# Altium schematic sheet SD3plus.SchDoc
size 431 x 279 mm; SheetNumber: 1; SheetTotal: 1; ENG_APP_DATE: --/--/--; DSN_APP_DATE: --/--/--; CHK_APP_DATE: --/--/--
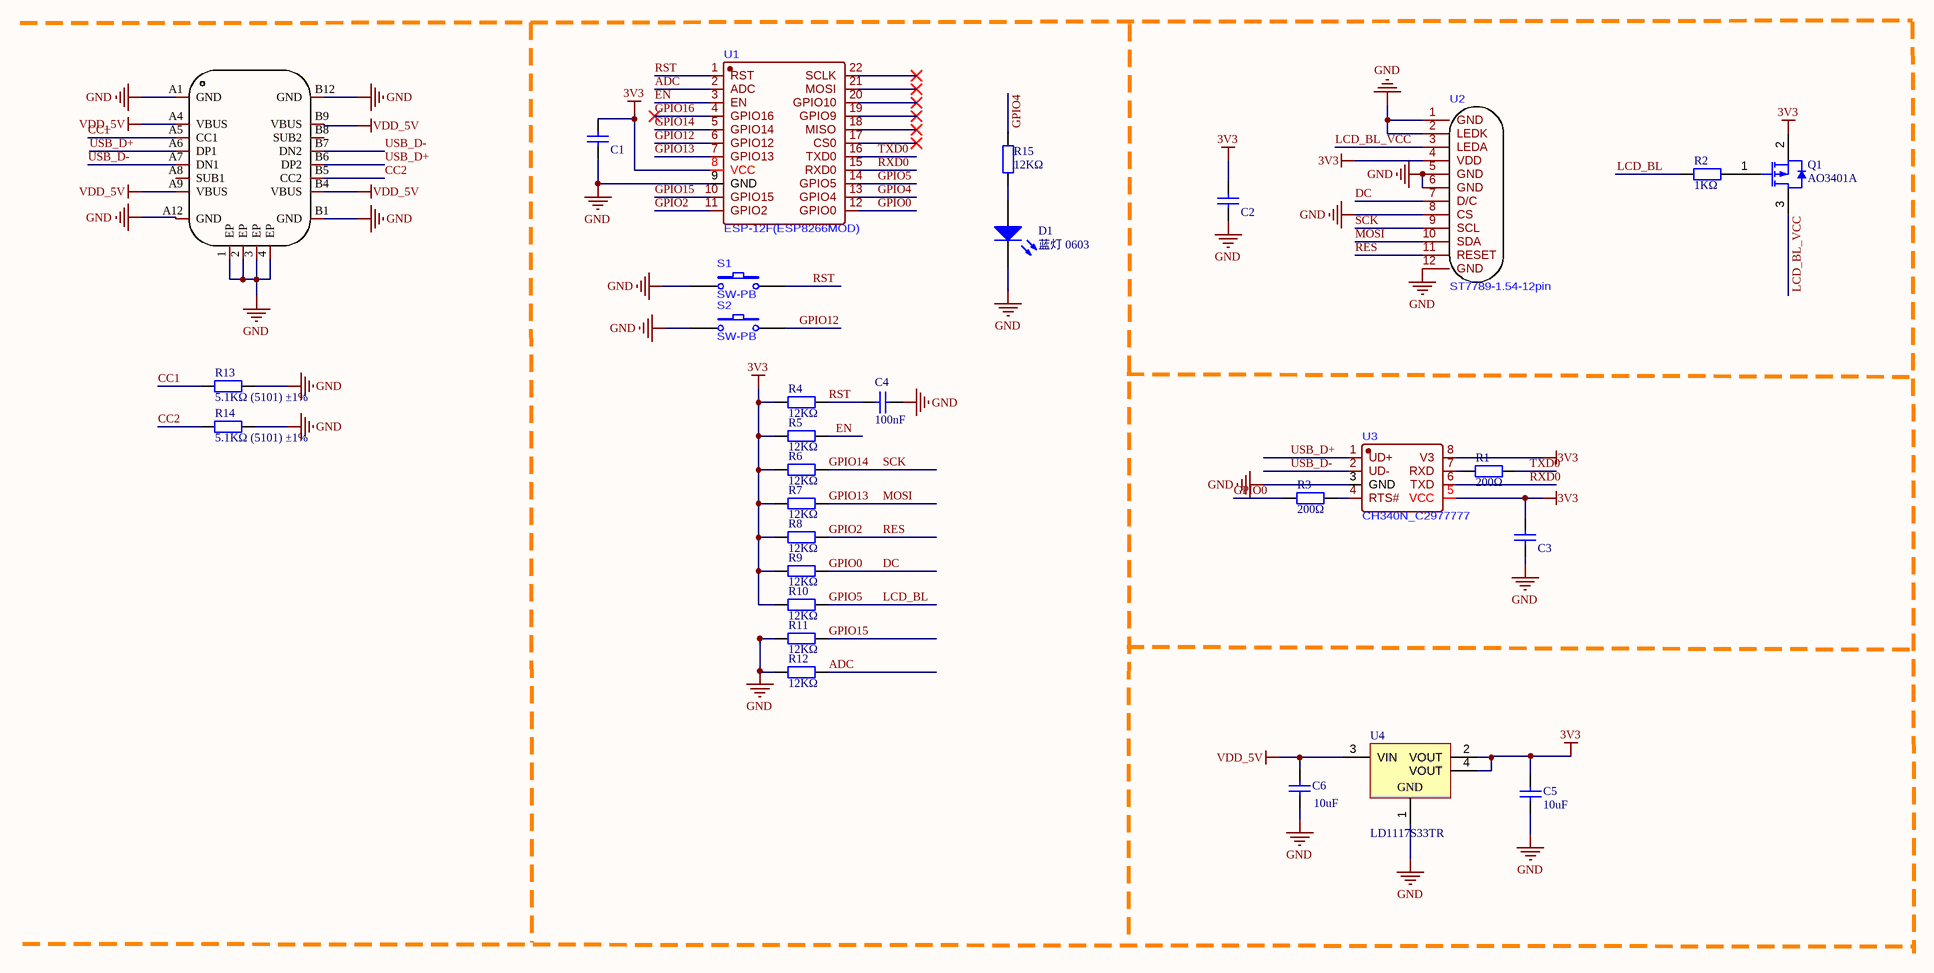
[diagram p0: SD3plus.SchDoc]

## Parts
?  KH-TYPE-C-16P  [USB-C-SMD_KH-TYPE-C-16P]  (value not drawn)
C1  0603 100nF (104) 10% 50V  [0603_C]  (value not drawn)
C2  0603 100nF (104) 10% 50V  [0603_C]  (value not drawn)
C3  0603 100nF (104) 10% 50V  [0603_C]  (value not drawn)
C4  100nF  [0603_C]
C5  10uF  [0603_C]
C6  10uF  [0603_C]
D1  蓝灯 0603  [0603_LED_S1]
Q1  AO3401A  [AO-SOT-23-3L_V]
R1  200Ω  [0603_R]
R2  1KΩ  [0603_R]
R3  200Ω  [0603_R]
R4  12KΩ  [0603_R]
R5  12KΩ  [0603_R]
R6  12KΩ  [0603_R]
R7  12KΩ  [0603_R]
R8  12KΩ  [0603_R]
R9  12KΩ  [0603_R]
R10  12KΩ  [0603_R]
R11  12KΩ  [0603_R]
R12  12KΩ  [0603_R]
R13  5.1KΩ (5101) ±1%  [0603_R]
R14  5.1KΩ (5101) ±1%  [0603_R]
R15  12KΩ  [0603_R]
S1  SW-PB  [SW-SMD_L3.9-W2.9-LS4.8-EH-A]
S2  SW-PB  [SW-SMD_L3.9-W2.9-LS4.8-EH-A]
U1  ESP-12F(ESP8266MOD)  [ESP-12F-ESP8266MOD]
U2  ST7789-1.54-12pin  [ST7789-1.54-12pin]
U3  CH340N_C2977777  [SOP-8_L4.9-W3.9-P1.27-LS6.0-BL]
U4  LD1117S33TR  [SOT-223_L]

## Nets
3V3: C1.2 C2.2 C3.2 C5.2 Q1.2(SOURCE) R4.1 R5.1 R6.1 R7.1 R8.1 R9.1 R10.1 U1.8(VCC) U2.4(VDD) U3.5(VCC) U3.8(V3) U4.2(VOUT) U4.4(VOUT)
GND: ?.1(EP) ?.2(EP) ?.3(EP) ?.4(EP) ?.A1(GND) ?.A12(GND) ?.B1(GND) ?.B12(GND) C1.1 C2.1 C3.1 C4.2 C5.1 C6.1 D1.K R11.1 R12.1 R13.2 R14.2 S1.1 S2.1 U1.9(GND) U2.1(GND) U2.2(LEDK) U2.5(GND) U2.6(GND) U2.8(CS) U2.12(GND) U3.3(GND) U4.1(GND)
VDD_5V: ?.A4(VBUS) ?.A9(VBUS) ?.B4(VBUS) ?.B9(VBUS) C6.2 U4.3(VIN)
ADC: R12.2 U1.2(ADC)
CC1: ?.A5(CC1) R13.1
CC2: ?.B5(CC2) R14.1
DC: R3.1 R9.2 U1.12(GPIO0) U2.7(D/C)  [also labelled GPIO0]
EN: R5.2 U1.3(EN)
GPIO2: R8.2 U1.11(GPIO2) U2.11(RESET)  [also labelled RES]
GPIO4: R15.1 U1.13(GPIO4)
GPIO5: R2.1 R10.2 U1.14(GPIO5)  [also labelled LCD_BL]
GPIO12: S2.2 U1.6(GPIO12)
GPIO13: R7.2 U1.7(GPIO13) U2.10(SDA)  [also labelled MOSI]
GPIO14: R6.2 U1.5(GPIO14) U2.9(SCL)  [also labelled SCK]
GPIO15: R11.2 U1.10(GPIO15)
GPIO16: U1.4(GPIO16)
LCD_BL_VCC: Q1.3(DRAIN) U2.3(LEDA)
RST: C4.1 R4.2 S1.2 U1.1(RST)
RXD0: U1.15(RXD0) U3.6(TXD)
TXD0: R1.2 U1.16(TXD0)
USB_D+: ?.A6(DP1) ?.B6(DP2) U3.1(UD+)
USB_D-: ?.A7(DN1) ?.B7(DN2) U3.2(UD-)
NetD1_A: D1.A R15.2
NetQ1_1: Q1.1(GATE) R2.2
NetR1_1: R1.1 U3.7(RXD)
NetR3_2: R3.2 U3.4(RTS#)

Not connected (* = marked no-connect by the designer): ? A8(SUB1) B8(SUB2); U1 17(CS0)* 18(MISO)* 19(GPIO9)* 20(GPIO10)* 21(MOSI)* 22(SCLK)*

## Notes on the sheet
- DWG. NO.
- REV.
- SHT.
- THIS DOCUMENT AND THE DATA DISCLOSED HEREIN OR HEREWITH IS THE PROPERTY OF ALTIUM LIMITED AND MAY BE FREELY DISTRIBUTED IN WHOLE. NO RIGHTS ARE RESERVED OR EXPRESS OR IMPLIED WARANTEE GIVEN.
- REVISION
- DESCRIPTION
- DATE
- APPROVED
- ENG:
- APPROVALS
- PROJECT
- DSN:
- CHK:
- REFERENCE DOCUMENTS
- PROJECT REVISION:
- TITLE
- DOCUMENT REVISION:
- DESIGN ITEM:
- BOM:
- FAB DWG:
- PCB DWG:
- ASSY DWG:
- SCALE:
- SIZE
- B
- CAGE CODE
- FILE NAME
- DWG NO.
- SHEET
- OF
- REV

## Library data of the parts
? = KH-TYPE-C-16P: Manufacturer: kinghelm(金航标); Add into BOM: yes; Connector Type: Type-C; Gender: 母座; Number of Contacts: 16; Number of Ports: 1; Current Rating - Power (Max): 3A; Symbol: KH-TYPE-C-16P; Device: KH-TYPE-C-16P; LCSC Part Name: Type-C 母座 卧贴; Supplier Part: C709357; Manufacturer Part: KH-TYPE-C-16P; Supplier Footprint: SMD; JLCPCB Part Class: Extended Part; Datasheet: https://atta.szlcsc.com/upload/public/pdf/source/20200911/C709357_AA8DCEB38BB20E3035A7ED7AE7667837.pdf; Supplier: LCSC; Convert to PCB: yes; Standard: -; Mounting Style: 卧贴; Operating Temperature Range: -40℃~+85℃
C1-C3 = CMP-001-00128-1: 贴片电容; ComponentLink1URL: http://www.szlcsc.com/product/details_15331.html; Source: ZJUShinelib.SchLib; Case/Package: 0603; Pins: 2; Component Type: Standard; Design Item ID: 0603 100nF (104) 10% 50V; ComponentLink1Description: 供应商链接
C4 = 0603 100nF (104) 10% 50V: 贴片电容; ComponentLink1Description: 供应商链接; ComponentLink1URL: http://www.szlcsc.com/product/details_15331.html; Package: 0603; Supplier: LC; SuppliersPartNumber: C14663
C5 C6 = 0603 10uF (106) 10% 10V: 贴片电容; ComponentLink1Description: 供应商链接; ComponentLink1URL: http://www.szlcsc.com/product/details_20411.html; Package: 0603; Supplier: LC; SuppliersPartNumber: C19702
D1 = 0603 蓝灯: 发光二极管; ComponentLink1Description: 供应商链接; ComponentLink1URL: http://www.szlcsc.com/product/details_73150.html; Package: 0603; Supplier: LC; SuppliersPartNumber: C72041
Q1 = CMP-2000-05778-1: P-Channel MOSFET, 30 V, 4 A, -55 to 150 degC, 3-Pin SOT-23-3L, RoHS, Tape and Reel; Manufacturer: Alpha and Omega; Output Power (Max): NotRequiredW; Power Dissipation: 1.4W; Rad Hardened: No; Drain Efficiency: NotRequired%; Drain-Source On-Volt: 30V; Noise Figure: NotRequireddB; Frequency (Max): NotRequiredMHz; Number of  Elements: 1; Gate-Source Voltage (Max): ?12V; Drain Current (Max): 4A; Channel Mode: Enhancement; Drain-Source On-Res: 0.044ohm; Type: PowerMOSFET; Polarity: P; Package URL: http://www.aosmd.com/res/packaging_information/SOT-23-3L.pdf; Datasheet URL: http://www.aosmd.com/res/data_sheets/AO3401A.pdf; Package Type: SOT-23; Package Description: 3-Pin Small Outline Transistor, Body 2.95 x 1.6 mm, Pitch 0.95 mm; Mounting: SurfaceMount; Manufacturer URL: http://www.aosmd.com/; Continuous Drain Current: 4A; Package Reference: SOT-23-3L; Mounting Technology: SurfaceMount; Operating Temperature Classification: Military; Power Gain: NotRequireddB; Datasheet Version: Rev. 3, 03/2011; Operating Temp Range: -55Cto150C; Pin Count: 3
R1 R3 = 0603 200Ω (2000) 1%: 贴片电阻; ComponentLink1Description: 供应商链接; ComponentLink1URL: http://www.szlcsc.com/product/details_8708.html; Package: 0603; Supplier: LC; SuppliersPartNumber: C8218
R2 = 0603 1KΩ (1001) 1%: 贴片电阻; ComponentLink1Description: 供应商链接; ComponentLink1URL: http://www.szlcsc.com/product/details_21904.html; Package: 0603; Supplier: LC; SuppliersPartNumber: C21190
R4-R12 R15 = 0603 12KΩ (1202) 1%: 贴片电阻; ComponentLink1Description: 供应商链接; ComponentLink1URL: http://www.szlcsc.com/product/details_23517.html; Package: 0603; Supplier: LC; SuppliersPartNumber: C22790
R13 R14 = 0603 5.1KΩ (5101) 1%: 贴片电阻; ComponentLink1Description: 供应商链接; ComponentLink1URL: http://www.szlcsc.com/product/details_23913.html; Package: 0603; Supplier: LC; SuppliersPartNumber: C23186
U4 = CMP-0244-00310-1: Fixed Low Drop Positive Voltage Regulator, 3.3V, 4-Pin SOT-223, Tape and Reel; ComponentLink2Description: Datasheet; PackageDescription: 4-Pin SOT-223 Package, 6.5 x 3.5 mm Body, 2.3 mm Pitch, 7 mm Lead Span; PackageVersion: 2010; ComponentLink2URL: http://www.st.com/internet/com/TECHNICAL_RESOURCES/TECHNICAL_LITERATURE/DATASHEET/CD00000544.pdf; PackageReference: SOT-223; DatasheetVersion: 1/11/2011; ComponentLink1Description: Manufacturer URL; ComponentLink1URL: http://www.st.com